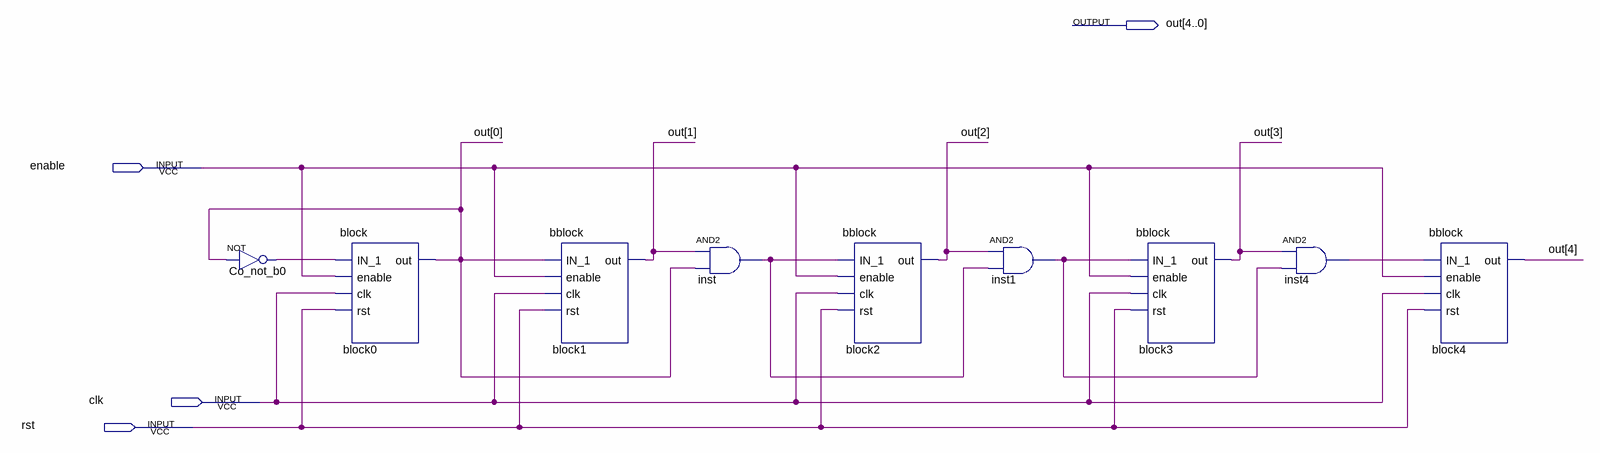
[diagram p0: schematic sheet]
// Quartus schematic synccounter.bdf as structural Verilog: 9 symbols, 4 pins
module synccounter (
  input  enable,
  input  clk,
  input  rst,
  output [4:0] out
);

  wire Co_not_b0_out, inst1_out, inst4_out, inst_out;

  not Co_not_b0 (Co_not_b0_out, out[0]);
  block block0 (.IN_1(Co_not_b0_out), .enable(enable), .clk(clk), .rst(rst), .out(out[0]));
  bblock block1 (.IN_1(out[0]), .enable(enable), .clk(clk), .rst(rst), .out(out[1]));
  and inst (inst_out, out[1], out[0]);
  bblock block2 (.IN_1(inst_out), .enable(enable), .clk(clk), .rst(rst), .out(out[2]));
  and inst1 (inst1_out, out[2], inst_out);
  bblock block3 (.IN_1(inst1_out), .enable(enable), .clk(clk), .rst(rst), .out(out[3]));
  and inst4 (inst4_out, out[3], inst1_out);
  bblock block4 (.IN_1(inst4_out), .enable(enable), .clk(clk), .rst(rst), .out(out[4]));
endmodule
